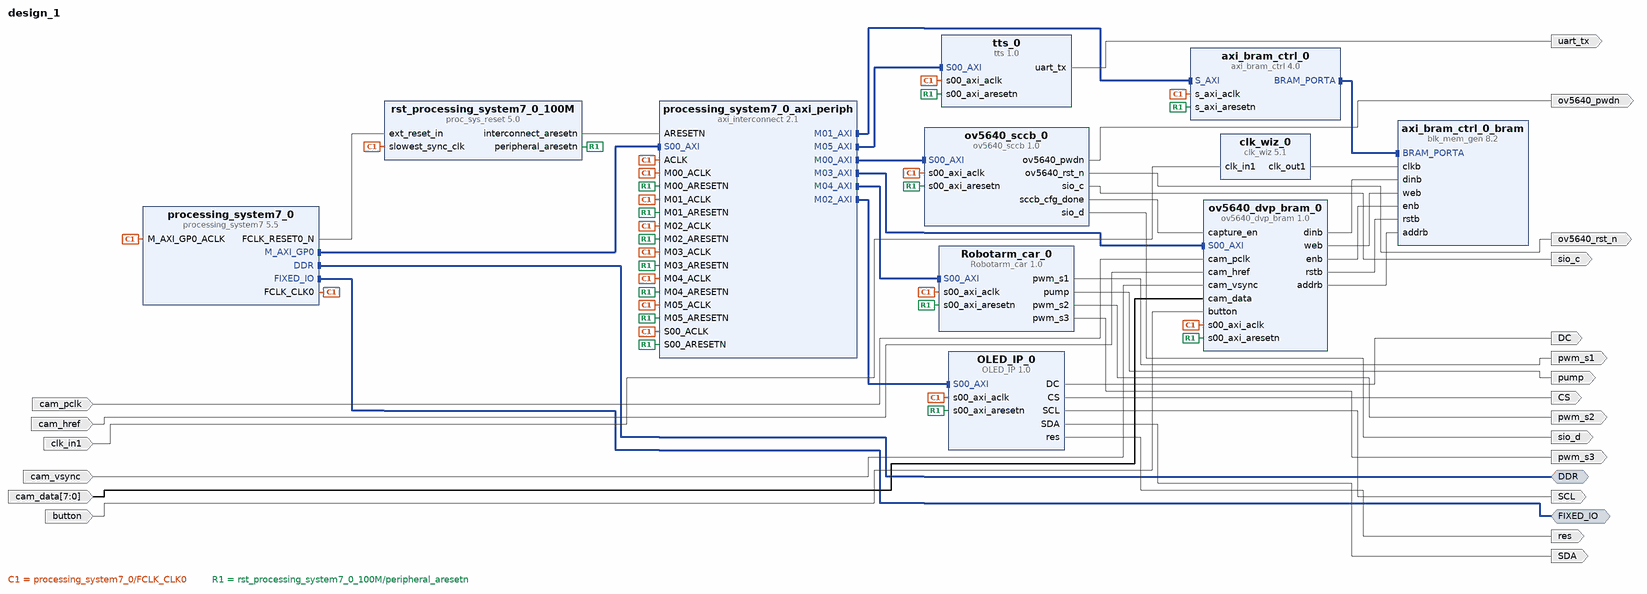
[diagram p0: block diagram of the top level]
# Vivado block design design_1, Vivado 2015.2
create_bd_design design_1

create_bd_intf_port -mode Master -vlnv xilinx.com:interface:ddrx_rtl:1.0 DDR
create_bd_intf_port -mode Master -vlnv xilinx.com:display_processing_system7:fixedio_rtl:1.0 FIXED_IO
create_bd_port -dir I cam_pclk
create_bd_port -dir I cam_href
create_bd_port -dir I cam_vsync
create_bd_port -dir I -from 7 -to 0 cam_data
create_bd_port -dir I button
create_bd_port -dir I -type clk clk_in1
create_bd_port -dir O ov5640_pwdn
create_bd_port -dir O ov5640_rst_n
create_bd_port -dir O sio_c
create_bd_port -dir O sio_d
create_bd_port -dir O pwm_s1
create_bd_port -dir O pwm_s2
create_bd_port -dir O pwm_s3
create_bd_port -dir O pump
create_bd_port -dir O SCL
create_bd_port -dir O SDA
create_bd_port -dir O DC
create_bd_port -dir O res
create_bd_port -dir O CS
create_bd_port -dir O uart_tx

create_bd_cell -type ip -vlnv xilinx.com:ip:processing_system7:5.5 processing_system7_0
set_property -dict [list \
  CONFIG.PCW_FCLK_CLK0_BUF true \
  CONFIG.PCW_UIPARAM_DDR_FREQ_MHZ 533.333333 \
  CONFIG.PCW_APU_PERIPHERAL_FREQMHZ 666.666666 \
  CONFIG.PCW_SDIO_PERIPHERAL_FREQMHZ 100 \
  CONFIG.PCW_UART_PERIPHERAL_FREQMHZ 100 \
  CONFIG.PCW_FPGA0_PERIPHERAL_FREQMHZ 100 \
  CONFIG.PCW_FPGA1_PERIPHERAL_FREQMHZ 50 \
  CONFIG.PCW_M_AXI_GP0_FREQMHZ 100 \
  CONFIG.PCW_PERIPHERAL_BOARD_PRESET None \
  CONFIG.PCW_PRESET_BANK1_VOLTAGE {LVCMOS 1.8V} \
  CONFIG.PCW_UIPARAM_DDR_PARTNO {MT41K128M16 JT-125} \
  CONFIG.PCW_QSPI_PERIPHERAL_ENABLE 1 \
  CONFIG.PCW_QSPI_QSPI_IO {MIO 1 .. 6} \
  CONFIG.PCW_QSPI_GRP_SINGLE_SS_ENABLE 1 \
  CONFIG.PCW_QSPI_GRP_SINGLE_SS_IO {MIO 1 .. 6} \
  CONFIG.PCW_ENET0_PERIPHERAL_ENABLE 1 \
  CONFIG.PCW_ENET0_ENET0_IO {MIO 16 .. 27} \
  CONFIG.PCW_ENET0_GRP_MDIO_ENABLE 1 \
  CONFIG.PCW_ENET0_GRP_MDIO_IO {MIO 52 .. 53} \
  CONFIG.PCW_ENET_RESET_ENABLE 1 \
  CONFIG.PCW_ENET_RESET_SELECT {Share reset pin} \
  CONFIG.PCW_ENET0_RESET_ENABLE 0 \
  CONFIG.PCW_SD0_PERIPHERAL_ENABLE 1 \
  CONFIG.PCW_SD0_SD0_IO {MIO 40 .. 45} \
  CONFIG.PCW_SD0_GRP_CD_ENABLE 1 \
  CONFIG.PCW_SD0_GRP_CD_IO {MIO 47} \
  CONFIG.PCW_SD0_GRP_WP_ENABLE 1 \
  CONFIG.PCW_SD0_GRP_WP_IO {MIO 46} \
  CONFIG.PCW_UART1_PERIPHERAL_ENABLE 1 \
  CONFIG.PCW_UART1_UART1_IO {MIO 48 .. 49} \
  CONFIG.PCW_TTC0_PERIPHERAL_ENABLE 1 \
  CONFIG.PCW_TTC0_TTC0_IO EMIO \
  CONFIG.PCW_USB0_PERIPHERAL_ENABLE 1 \
  CONFIG.PCW_USB0_USB0_IO {MIO 28 .. 39} \
  CONFIG.PCW_USB_RESET_ENABLE 1 \
  CONFIG.PCW_USB_RESET_SELECT {Share reset pin} \
  CONFIG.PCW_USB0_RESET_ENABLE 0 \
  CONFIG.PCW_I2C_RESET_ENABLE 1 \
  CONFIG.PCW_GPIO_MIO_GPIO_ENABLE 1 \
  CONFIG.PCW_GPIO_MIO_GPIO_IO MIO \
] [get_bd_cells processing_system7_0]
# 501 more settings of processing_system7_0 are not shown: defaults, MIO pin electricals, DDR timing, and values the tool derives
create_bd_cell -type ip -vlnv xilinx.com:user:ov5640_dvp_bram:1.0 ov5640_dvp_bram_0
create_bd_cell -type ip -vlnv xilinx.com:ip:axi_interconnect:2.1 processing_system7_0_axi_periph
set_property -dict {CONFIG.NUM_MI 6} [get_bd_cells processing_system7_0_axi_periph]
create_bd_cell -type ip -vlnv xilinx.com:ip:proc_sys_reset:5.0 rst_processing_system7_0_100M
create_bd_cell -type ip -vlnv xilinx.com:ip:clk_wiz:5.1 clk_wiz_0
set_property -dict [list \
  CONFIG.CLKOUT1_REQUESTED_OUT_FREQ 500.000 \
  CONFIG.USE_LOCKED false \
  CONFIG.USE_RESET false \
  CONFIG.MMCM_DIVCLK_DIVIDE 1 \
  CONFIG.MMCM_CLKOUT0_DIVIDE_F 2.000 \
  CONFIG.CLKOUT1_JITTER 97.082 \
] [get_bd_cells clk_wiz_0]
create_bd_cell -type ip -vlnv xilinx.com:user:ov5640_sccb:1.0 ov5640_sccb_0
create_bd_cell -type ip -vlnv xilinx.com:ip:axi_bram_ctrl:4.0 axi_bram_ctrl_0
set_property -dict {CONFIG.SINGLE_PORT_BRAM 1} [get_bd_cells axi_bram_ctrl_0]
create_bd_cell -type ip -vlnv xilinx.com:ip:blk_mem_gen:8.2 axi_bram_ctrl_0_bram
set_property -dict [list \
  CONFIG.Memory_Type True_Dual_Port_RAM \
  CONFIG.Enable_B Use_ENB_Pin \
  CONFIG.Use_RSTB_Pin true \
  CONFIG.Port_B_Clock 100 \
  CONFIG.Port_B_Write_Rate 50 \
  CONFIG.Port_B_Enable_Rate 100 \
] [get_bd_cells axi_bram_ctrl_0_bram]
create_bd_cell -type ip -vlnv xilinx.com:user:Robotarm_car:1.0 Robotarm_car_0
create_bd_cell -type ip -vlnv xilinx.com:user:OLED_IP:1.0 OLED_IP_0
create_bd_cell -type ip -vlnv xilinx.com:user:tts:1.0 tts_0

# ---- connections ----

connect_bd_intf_net [get_bd_intf_pins processing_system7_0/M_AXI_GP0] [get_bd_intf_pins processing_system7_0_axi_periph/S00_AXI]
connect_bd_intf_net [get_bd_intf_pins processing_system7_0_axi_periph/M03_AXI] [get_bd_intf_pins ov5640_dvp_bram_0/S00_AXI]
connect_bd_intf_net [get_bd_intf_pins processing_system7_0_axi_periph/M00_AXI] [get_bd_intf_pins ov5640_sccb_0/S00_AXI]
connect_bd_intf_net [get_bd_intf_pins processing_system7_0_axi_periph/M01_AXI] [get_bd_intf_pins axi_bram_ctrl_0/S_AXI]
connect_bd_intf_net [get_bd_intf_pins axi_bram_ctrl_0_bram/BRAM_PORTA] [get_bd_intf_pins axi_bram_ctrl_0/BRAM_PORTA]
connect_bd_intf_net [get_bd_intf_pins processing_system7_0_axi_periph/M02_AXI] [get_bd_intf_pins OLED_IP_0/S00_AXI]
connect_bd_intf_net [get_bd_intf_pins processing_system7_0_axi_periph/M04_AXI] [get_bd_intf_pins Robotarm_car_0/S00_AXI]
connect_bd_intf_net [get_bd_intf_pins processing_system7_0_axi_periph/M05_AXI] [get_bd_intf_pins tts_0/S00_AXI]
connect_bd_intf_net [get_bd_intf_ports DDR] [get_bd_intf_pins processing_system7_0/DDR]
connect_bd_intf_net [get_bd_intf_ports FIXED_IO] [get_bd_intf_pins processing_system7_0/FIXED_IO]
connect_bd_net [get_bd_pins processing_system7_0/FCLK_CLK0] \
  [get_bd_pins processing_system7_0/M_AXI_GP0_ACLK] [get_bd_pins rst_processing_system7_0_100M/slowest_sync_clk] \
  [get_bd_pins ov5640_dvp_bram_0/s00_axi_aclk] [get_bd_pins ov5640_sccb_0/s00_axi_aclk] \
  [get_bd_pins axi_bram_ctrl_0/s_axi_aclk] [get_bd_pins Robotarm_car_0/s00_axi_aclk] [get_bd_pins OLED_IP_0/s00_axi_aclk] \
  [get_bd_pins processing_system7_0_axi_periph/S00_ACLK] [get_bd_pins processing_system7_0_axi_periph/ACLK] \
  [get_bd_pins processing_system7_0_axi_periph/M00_ACLK] [get_bd_pins processing_system7_0_axi_periph/M01_ACLK] \
  [get_bd_pins processing_system7_0_axi_periph/M02_ACLK] [get_bd_pins processing_system7_0_axi_periph/M03_ACLK] \
  [get_bd_pins processing_system7_0_axi_periph/M04_ACLK] [get_bd_pins processing_system7_0_axi_periph/M05_ACLK] \
  [get_bd_pins tts_0/s00_axi_aclk]
connect_bd_net [get_bd_pins processing_system7_0/FCLK_RESET0_N] [get_bd_pins rst_processing_system7_0_100M/ext_reset_in]
connect_bd_net [get_bd_pins rst_processing_system7_0_100M/peripheral_aresetn] \
  [get_bd_pins ov5640_dvp_bram_0/s00_axi_aresetn] [get_bd_pins ov5640_sccb_0/s00_axi_aresetn] \
  [get_bd_pins axi_bram_ctrl_0/s_axi_aresetn] [get_bd_pins Robotarm_car_0/s00_axi_aresetn] \
  [get_bd_pins OLED_IP_0/s00_axi_aresetn] [get_bd_pins processing_system7_0_axi_periph/S00_ARESETN] \
  [get_bd_pins processing_system7_0_axi_periph/M00_ARESETN] [get_bd_pins processing_system7_0_axi_periph/M01_ARESETN] \
  [get_bd_pins processing_system7_0_axi_periph/M02_ARESETN] [get_bd_pins processing_system7_0_axi_periph/M03_ARESETN] \
  [get_bd_pins processing_system7_0_axi_periph/M04_ARESETN] [get_bd_pins processing_system7_0_axi_periph/M05_ARESETN] \
  [get_bd_pins tts_0/s00_axi_aresetn]
connect_bd_net [get_bd_pins rst_processing_system7_0_100M/interconnect_aresetn] [get_bd_pins processing_system7_0_axi_periph/ARESETN]
connect_bd_net [get_bd_ports cam_pclk] [get_bd_pins ov5640_dvp_bram_0/cam_pclk]
connect_bd_net [get_bd_ports cam_href] [get_bd_pins ov5640_dvp_bram_0/cam_href]
connect_bd_net [get_bd_ports cam_vsync] [get_bd_pins ov5640_dvp_bram_0/cam_vsync]
connect_bd_net [get_bd_ports cam_data] [get_bd_pins ov5640_dvp_bram_0/cam_data]
connect_bd_net [get_bd_ports button] [get_bd_pins ov5640_dvp_bram_0/button]
connect_bd_net -net clk_in1_1 [get_bd_ports clk_in1] [get_bd_pins clk_wiz_0/clk_in1]
connect_bd_net [get_bd_pins ov5640_sccb_0/ov5640_pwdn] [get_bd_ports ov5640_pwdn]
connect_bd_net [get_bd_pins ov5640_sccb_0/ov5640_rst_n] [get_bd_ports ov5640_rst_n]
connect_bd_net [get_bd_pins ov5640_sccb_0/sio_c] [get_bd_ports sio_c]
connect_bd_net [get_bd_pins ov5640_sccb_0/sio_d] [get_bd_ports sio_d]
connect_bd_net [get_bd_pins ov5640_sccb_0/sccb_cfg_done] [get_bd_pins ov5640_dvp_bram_0/capture_en]
connect_bd_net [get_bd_pins ov5640_dvp_bram_0/dinb] [get_bd_pins axi_bram_ctrl_0_bram/dinb]
connect_bd_net [get_bd_pins ov5640_dvp_bram_0/web] [get_bd_pins axi_bram_ctrl_0_bram/web]
connect_bd_net [get_bd_pins ov5640_dvp_bram_0/enb] [get_bd_pins axi_bram_ctrl_0_bram/enb]
connect_bd_net [get_bd_pins ov5640_dvp_bram_0/rstb] [get_bd_pins axi_bram_ctrl_0_bram/rstb]
connect_bd_net [get_bd_pins ov5640_dvp_bram_0/addrb] [get_bd_pins axi_bram_ctrl_0_bram/addrb]
connect_bd_net [get_bd_pins clk_wiz_0/clk_out1] [get_bd_pins axi_bram_ctrl_0_bram/clkb]
connect_bd_net [get_bd_pins Robotarm_car_0/pwm_s1] [get_bd_ports pwm_s1]
connect_bd_net [get_bd_pins Robotarm_car_0/pwm_s2] [get_bd_ports pwm_s2]
connect_bd_net [get_bd_pins Robotarm_car_0/pwm_s3] [get_bd_ports pwm_s3]
connect_bd_net [get_bd_pins Robotarm_car_0/pump] [get_bd_ports pump]
connect_bd_net [get_bd_pins OLED_IP_0/SCL] [get_bd_ports SCL]
connect_bd_net [get_bd_pins OLED_IP_0/SDA] [get_bd_ports SDA]
connect_bd_net [get_bd_pins OLED_IP_0/DC] [get_bd_ports DC]
connect_bd_net [get_bd_pins OLED_IP_0/res] [get_bd_ports res]
connect_bd_net [get_bd_pins OLED_IP_0/CS] [get_bd_ports CS]
connect_bd_net [get_bd_pins tts_0/uart_tx] [get_bd_ports uart_tx]

# ---- address map ----
assign_bd_address -offset 0x40000000 -range 512K -target_address_space [get_bd_addr_spaces processing_system7_0/Data] [get_bd_addr_segs axi_bram_ctrl_0/S_AXI/Mem0]
assign_bd_address -offset 0x43C00000 -range 64K -target_address_space [get_bd_addr_spaces processing_system7_0/Data] [get_bd_addr_segs ov5640_sccb_0/S00_AXI/S00_AXI_reg]
assign_bd_address -offset 0x43C10000 -range 64K -target_address_space [get_bd_addr_spaces processing_system7_0/Data] [get_bd_addr_segs OLED_IP_0/S00_AXI/S00_AXI_reg]
assign_bd_address -offset 0x43C20000 -range 64K -target_address_space [get_bd_addr_spaces processing_system7_0/Data] [get_bd_addr_segs Robotarm_car_0/S00_AXI/S00_AXI_reg]
assign_bd_address -offset 0x43C30000 -range 64K -target_address_space [get_bd_addr_spaces processing_system7_0/Data] [get_bd_addr_segs ov5640_dvp_bram_0/S00_AXI/S00_AXI_reg]
assign_bd_address -offset 0x43C40000 -range 64K -target_address_space [get_bd_addr_spaces processing_system7_0/Data] [get_bd_addr_segs tts_0/S00_AXI/S00_AXI_reg]

validate_bd_design
save_bd_design
